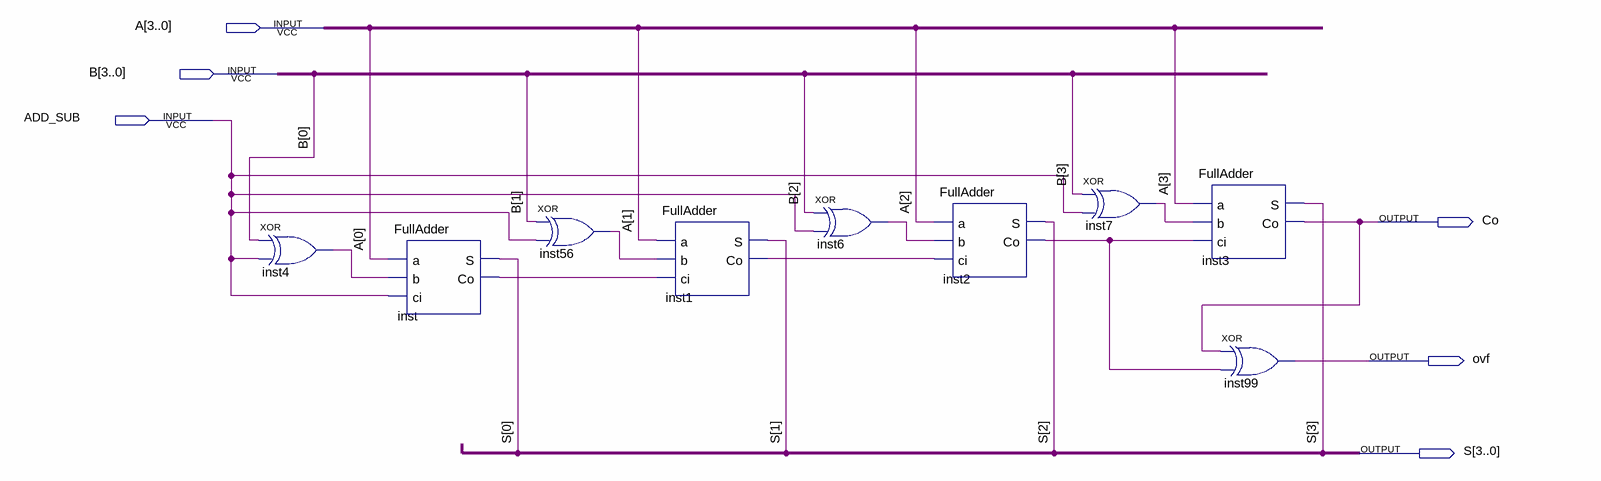
[diagram p0: schematic sheet]
// Quartus schematic AddSub4.bdf as structural Verilog: 9 symbols, 6 pins
module AddSub4 (
  input  [3:0] A,
  input  [3:0] B,
  input  ADD_SUB,
  output Co,
  output ovf,
  output [3:0] S
);

  wire inst1_co, inst2_co, inst4_out, inst6_out, inst7_out, inst56_out, inst_co;

  xor inst4 (inst4_out, B[0], ADD_SUB);
  FullAdder inst (.a(A[0]), .b(inst4_out), .ci(ADD_SUB), .S(S[0]), .Co(inst_co));
  xor inst56 (inst56_out, B[1], ADD_SUB);
  FullAdder inst1 (.a(A[1]), .b(inst56_out), .ci(inst_co), .S(S[1]), .Co(inst1_co));
  xor inst6 (inst6_out, B[2], ADD_SUB);
  FullAdder inst2 (.a(A[2]), .b(inst6_out), .ci(inst1_co), .S(S[2]), .Co(inst2_co));
  xor inst7 (inst7_out, B[3], ADD_SUB);
  FullAdder inst3 (.a(A[3]), .b(inst7_out), .ci(inst2_co), .S(S[3]), .Co(Co));
  xor inst99 (ovf, Co, inst2_co);
endmodule
